# EAGLE design stylophone (EAGLE 5.09)
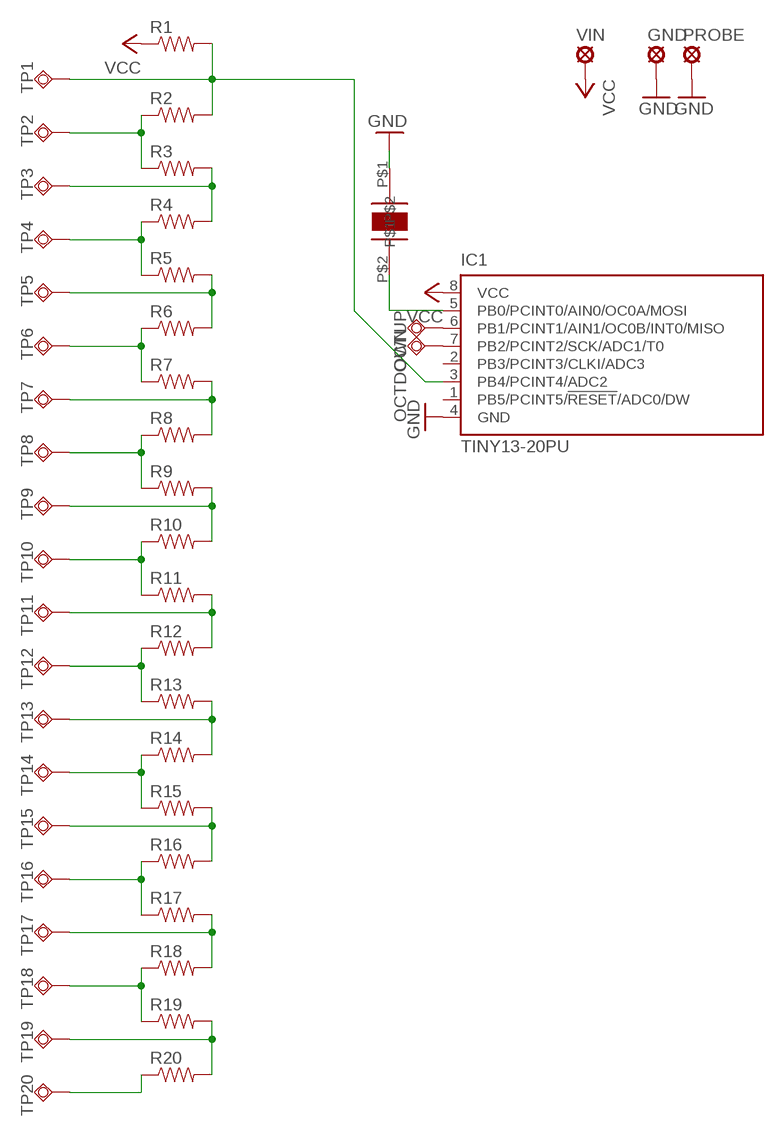
[diagram p0: schematic, sheet 1]

## Parts
GND  SE14  [SE14]
IC1  TINY13-20PU  [DIL08]
OCTDOWN  TPSQB2,54  [B2,54]
OCTUP  TPSQB2,54  [B2,54]
PROBE  SE14  [SE14]
R1  RESISTORPTH1  [AXIAL-0.3]
R2  RESISTORPTH1  [AXIAL-0.3]
R3  RESISTORPTH1  [AXIAL-0.3]
R4  RESISTORPTH1  [AXIAL-0.3]
R5  RESISTORPTH1  [AXIAL-0.3]
R6  RESISTORPTH1  [AXIAL-0.3]
R7  RESISTORPTH1  [AXIAL-0.3]
R8  RESISTORPTH1  [AXIAL-0.3]
R9  RESISTORPTH1  [AXIAL-0.3]
R10  RESISTORPTH1  [AXIAL-0.3]
R11  RESISTORPTH1  [AXIAL-0.3]
R12  RESISTORPTH1  [AXIAL-0.3]
R13  RESISTORPTH1  [AXIAL-0.3]
R14  RESISTORPTH1  [AXIAL-0.3]
R15  RESISTORPTH1  [AXIAL-0.3]
R16  RESISTORPTH1  [AXIAL-0.3]
R17  RESISTORPTH1  [AXIAL-0.3]
R18  RESISTORPTH1  [AXIAL-0.3]
R19  RESISTORPTH1  [AXIAL-0.3]
R20  RESISTORPTH1  [AXIAL-0.3]
TP1  TPSQB2,54  [B2,54]
TP2  TPSQB2,54  [B2,54]
TP3  TPSQB2,54  [B2,54]
TP4  TPSQB2,54  [B2,54]
TP5  TPSQB2,54  [B2,54]
TP6  TPSQB2,54  [B2,54]
TP7  TPSQB2,54  [B2,54]
TP8  TPSQB2,54  [B2,54]
TP9  TPSQB2,54  [B2,54]
TP10  TPSQB2,54  [B2,54]
TP11  TPSQB2,54  [B2,54]
TP12  TPSQB2,54  [B2,54]
TP13  TPSQB2,54  [B2,54]
TP14  TPSQB2,54  [B2,54]
TP15  TPSQB2,54  [B2,54]
TP16  TPSQB2,54  [B2,54]
TP17  TPSQB2,54  [B2,54]
TP18  TPSQB2,54  [B2,54]
TP19  TPSQB2,54  [B2,54]
TP20  TPSQB2,54  [B2,54]
U$1  PS1420P02AT  [PS1420P02AT]
VIN  SE14  [SE14]

## Nets
GND: GND.MP IC1.4(GND) PROBE.MP U$1.P$1
N$1: R2.P$1 R3.P$1 TP2.TP
N$2: R4.P$1 R5.P$1 TP4.TP
N$3: R6.P$1 R7.P$1 TP6.TP
N$4: R8.P$1 R9.P$1 TP8.TP
N$5: R10.P$1 R11.P$1 TP10.TP
N$6: R12.P$1 R13.P$1 TP12.TP
N$7: R14.P$1 R15.P$1 TP14.TP
N$8: R16.P$1 R17.P$1 TP16.TP
N$9: R18.P$1 R19.P$1 TP18.TP
N$10: R20.P$1 TP20.TP
N$11: R19.P$2 R20.P$2 TP19.TP
N$12: R17.P$2 R18.P$2 TP17.TP
N$13: R15.P$2 R16.P$2 TP15.TP
N$14: R13.P$2 R14.P$2 TP13.TP
N$15: R11.P$2 R12.P$2 TP11.TP
N$16: R9.P$2 R10.P$2 TP9.TP
N$17: R7.P$2 R8.P$2 TP7.TP
N$18: R5.P$2 R6.P$2 TP5.TP
N$19: R3.P$2 R4.P$2 TP3.TP
N$20: IC1.3(PB4/PCINT4/ADC2) R1.P$2 R2.P$2 TP1.TP
N$21: IC1.5(PB0/PCINT0/AIN0/OC0A/MOSI) U$1.P$2
N$22: IC1.6(PB1/PCINT1/AIN1/OC0B/INT0/MISO) OCTUP.TP
N$23: IC1.7(PB2/PCINT2/SCK/ADC1/T0) OCTDOWN.TP
VCC: IC1.8(VCC) R1.P$1 VIN.MP
Unconnected: IC1.1(PB5/PCINT5/!RESET!/ADC0/DW) IC1.2(PB3/PCINT3/CLKI/ADC3)

## Library data of the parts
GND PROBE VIN = solpad:SE14: SOLDER PAD E1553, drill 1,4mm, distributor Buerklin, 07F820
IC1 = atmel:TINY13: 8-bit AVR Microcontroller with 1K Bytes In-System Programmable Flash Source: http://www.atmel.com/dyn/resources/prod_documents/2535S.pdf
OCTDOWN OCTUP TP1-TP20 = testpad:TPSQ: Test pad
R1-R20 = SparkFun:RESISTOR: Resistor Basic schematic elements and footprints for 0603, 1206, and PTH 1/10th watt (small) resistors.
U$1 = piezo:PS1420P02AT

## Board
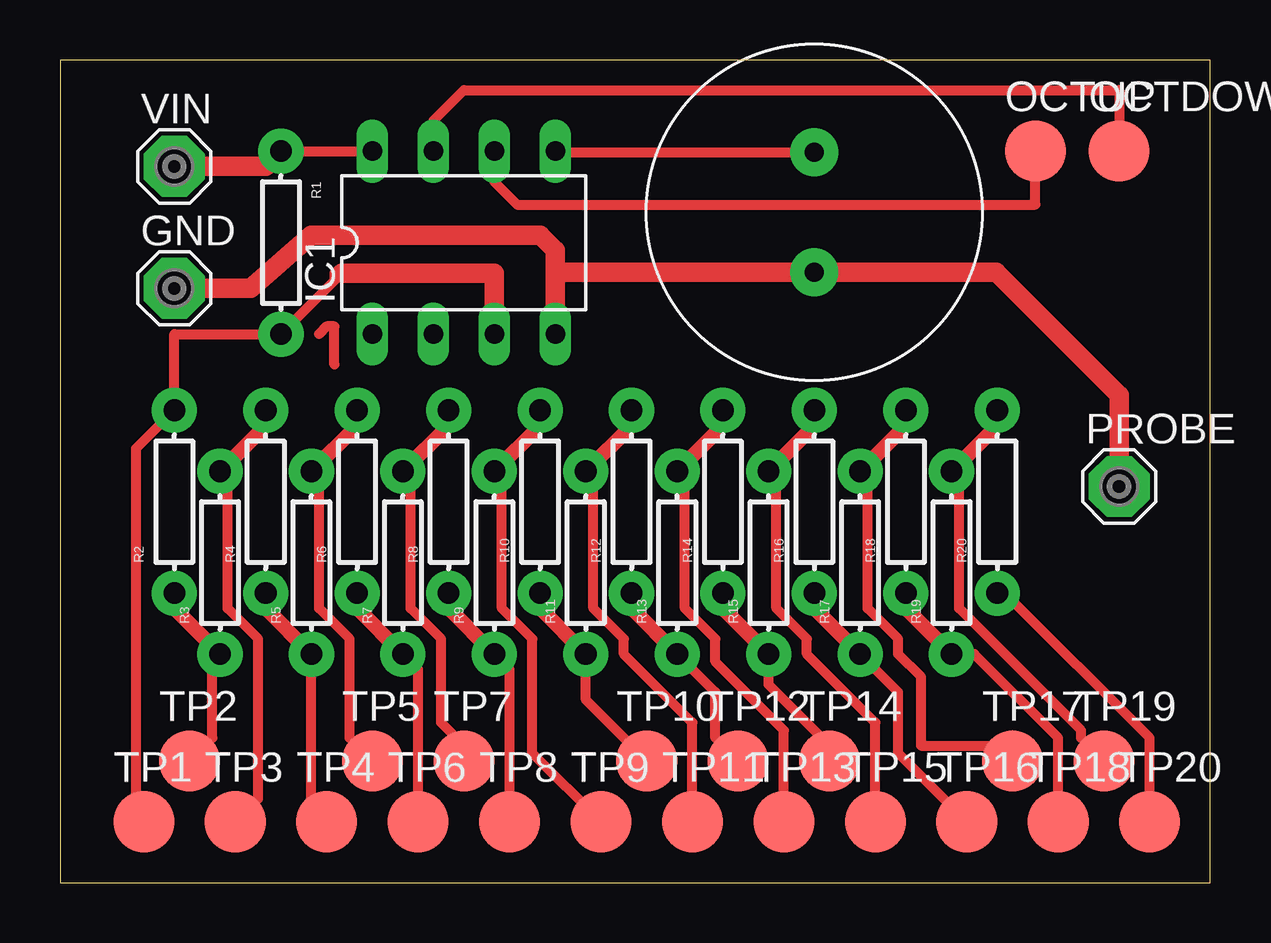
[diagram p1: board, top side]

Size 47.93 x 34.28 mm. Coordinates in mm from the lower left corner, seen from the top.
Outline: 0,0 47.93,0 47.93,34.28 0,34.28 0,0
Copper layers (1*16): Top 0.035mm / dielectric 1.5mm / Bottom 0.035mm
Design rules "default *": minimum track width 16mil, minimum drill 24mil, track to track 16mil, track to pad 16mil, pad to pad 16mil, via to via 16mil, smd to smd 16mil, copper to edge 40mil, drill to drill 8mil, minimum pad ring 10mil, minimum via ring 8mil, stop-mask expansion 4mil, vias tented up to drill 0mil, thermal gap 10mil

### Footprints (pad centres in the part's own frame; a part is rotated, then mirrored left to right if it is on the bottom)
SE14 = drill 1.397 pad 2.54 octagon: MP 0,0
DIL08 = drill 0.813 long: 1 -3.81,-3.81; 2 -1.27,-3.81; 3 1.27,-3.81; 4 3.81,-3.81; 5 3.81,3.81; 6 1.27,3.81; 7 -1.27,3.81; 8 -3.81,3.81
B2,54 = smd 2.54 x 2.54: TP 0,0
AXIAL-0.3 = drill 0.9 pad 1.88 round: P$1 -3.81,0; P$2 3.81,0
PS1420P02AT = drill 0.8 pad 2 round: P$1 -2.5,0; P$2 2.5,0

### Placement (x,y rotation side)
GND  4.76,24.77 0 top
IC1  16.83,26.67 0 top
OCTDOWN  44.13,30.48 0 top
OCTUP  40.64,30.48 0 top
PROBE  44.13,16.51 0 top
R1  9.21,26.67 270 top
R2  4.76,15.88 90 top
R3  6.67,13.34 90 top
R4  8.57,15.88 90 top
R5  10.48,13.34 90 top
R6  12.38,15.88 90 top
R7  14.29,13.34 90 top
R8  16.19,15.88 90 top
R9  18.1,13.34 90 top
R10  20,15.88 90 top
R11  21.91,13.34 90 top
R12  23.81,15.88 90 top
R13  25.72,13.34 90 top
R14  27.62,15.88 90 top
R15  29.53,13.34 90 top
R16  31.43,15.88 90 top
R17  33.34,13.34 90 top
R18  35.24,15.88 90 top
R19  37.15,13.34 90 top
R20  39.05,15.88 90 top
TP1  3.49,2.54 0 top
TP2  5.4,5.08 0 top
TP3  7.3,2.54 0 top
TP4  11.11,2.54 0 top
TP5  13.02,5.08 0 top
TP6  14.92,2.54 0 top
TP7  16.83,5.08 0 top
TP8  18.73,2.54 0 top
TP9  22.54,2.54 0 top
TP10  24.45,5.08 0 top
TP11  26.35,2.54 0 top
TP12  28.26,5.08 0 top
TP13  30.16,2.54 0 top
TP14  32.07,5.08 0 top
TP15  33.97,2.54 0 top
TP16  37.78,2.54 0 top
TP17  39.69,5.08 0 top
TP18  41.59,2.54 0 top
TP19  43.5,5.08 0 top
TP20  45.4,2.54 0 top
U$1  31.43,27.94 90 top
VIN  4.76,29.85 0 top

### Tracks (layer width: path | path; a pad name or v marks a point on that pad's centre or on a via)
GND
  Top 0.813: GND.MP 7.94,24.77 10.48,26.99 20,26.99 20.64,26.35 20.64,25.4 | 20.64,25.4 IC1.4 | 20.64,25.4 20.68,25.44 U$1.P$1 39.01,25.44 44.13,20.32 PROBE.MP
N$1
  Top 0.406: TP2.TP 6.35,6.03 6.35,9.52 R3.P$1
  Top 0.61: R2.P$1 4.76,11.43 R3.P$1
N$2
  Top 0.406: TP4.TP 10.48,3.17 R5.P$1
  Top 0.61: R4.P$1 8.57,11.43 R5.P$1
N$3
  Top 0.406: TP6.TP 14.92,8.89 R7.P$1
  Top 0.61: R6.P$1 12.38,11.43 R7.P$1
N$4
  Top 0.406: TP8.TP 18.73,8.89 R9.P$1
  Top 0.61: R8.P$1 16.19,11.43 R9.P$1
N$5
  Top 0.406: TP10.TP 21.91,7.62 R11.P$1
  Top 0.61: R10.P$1 20,11.43 R11.P$1
N$6
  Top 0.406: TP12.TP 27.31,6.03 27.31,7.94 R13.P$1
  Top 0.61: R12.P$1 23.81,11.43 R13.P$1
N$7
  Top 0.406: 32.07,5.72 29.53,8.25 R15.P$1
  Top 0.61: TP14.TP 32.07,5.72 | R14.P$1 27.62,11.43 R15.P$1
N$8
  Top 0.406: TP16.TP 34.92,5.4 34.92,7.94 R17.P$1
  Top 0.61: R16.P$1 31.43,11.43 R17.P$1
N$9
  Top 0.406: TP18.TP 41.59,6.03 38.1,9.52 R19.P$1
  Top 0.61: R18.P$1 35.24,11.43 R19.P$1
N$10
  Top 0.406: TP20.TP 45.4,6.03 39.37,12.07 R20.P$1
N$11
  Top 0.406: TP19.TP 42.55,6.03 42.55,6.35 37.46,11.43 37.46,17.14 R19.P$2
  Top 0.61: R20.P$2 39.05,19.05 R19.P$2
N$12
  Top 0.406: 39.69,5.72 35.88,5.72 35.88,8.57 34.92,9.52 34.92,10.16 33.66,11.43 33.66,17.14 R17.P$2
  Top 0.61: 39.69,5.72 TP17.TP | R18.P$2 35.24,19.05 R17.P$2
N$13
  Top 0.406: TP15.TP 33.97,6.67 31.11,9.52 31.11,10.16 29.85,11.43 29.85,17.14 R15.P$2
  Top 0.61: R16.P$2 31.43,19.05 R15.P$2
N$14
  Top 0.406: TP13.TP 30.16,6.35 27.31,9.21 27.31,10.16 26.04,11.43 26.04,17.14 R13.P$2
  Top 0.61: R14.P$2 27.62,19.05 R13.P$2
N$15
  Top 0.406: TP11.TP 26.35,6.67 23.49,9.52 23.49,10.16 22.22,11.43 22.22,17.14 R11.P$2
  Top 0.61: R12.P$2 23.81,19.05 R11.P$2
N$16
  Top 0.406: TP9.TP 19.69,5.4 19.69,10.16 18.42,11.43 18.42,17.14 R9.P$2
  Top 0.61: R10.P$2 20,19.05 R9.P$2
N$17
  Top 0.406: 16.83,5.72 15.87,6.67 15.87,10.16 14.61,11.43 14.61,17.14 R7.P$2
  Top 0.61: 16.83,5.72 TP7.TP | R8.P$2 16.19,19.05 R7.P$2
N$18
  Top 0.406: TP5.TP 12.06,6.03 12.06,10.16 10.79,11.43 10.79,17.14 R5.P$2
  Top 0.61: R6.P$2 12.38,19.05 R5.P$2
N$19
  Top 0.406: TP3.TP 8.26,3.49 8.26,10.16 6.98,11.43 6.98,17.14 R3.P$2
  Top 0.61: R4.P$2 8.57,19.05 R3.P$2
N$20
  Top 0.406: 11.75,25.4 11.43,25.4 11.43,25.08 R1.P$2 4.76,22.86 R2.P$2 3.17,18.1 3.17,2.86 TP1.TP
  Top 0.813: IC1.3 18.1,25.4 11.75,25.4
N$21
  Top 0.406: 20.68,30.44 U$1.P$2
  Top 0.813: IC1.5 20.68,30.44
N$22
  Top 0.406: IC1.6 18.1,29.21 19.05,28.26 40.64,28.26 OCTUP.TP
N$23
  Top 0.406: IC1.7 15.56,31.75 16.83,33.02 44.13,33.02 OCTDOWN.TP
N$24
  Top 0.406: 11.43,21.59 11.43,23.18 11.11,23.18 10.79,22.86
VCC
  Top 0.406: IC1.8 R1.P$1 8.89,30.16 8.89,29.85 8.57,29.85
  Top 0.813: VIN.MP 8.57,29.85